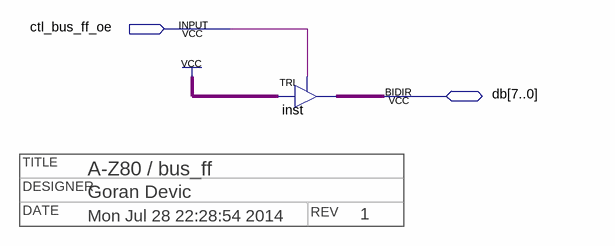
[diagram p0: schematic sheet]
// Quartus schematic bus_ff.bdf as structural Verilog: 1 symbols, 2 pins
// Title block: TITLE: A-Z80 / bus_ff; DESIGNER: Goran Devic; DATE: Mon Jul 28 22:28:54 2014; REV: 1
module bus_ff (
  input  ctl_bus_ff_oe,
  inout  [7:0] db
);

  TRI inst[7:0] (.IN({8{1'b1}}), .OE(ctl_bus_ff_oe), .OUT(db));
endmodule
